# EAGLE schematic InteractionBoard (EAGLE 9.6.2)
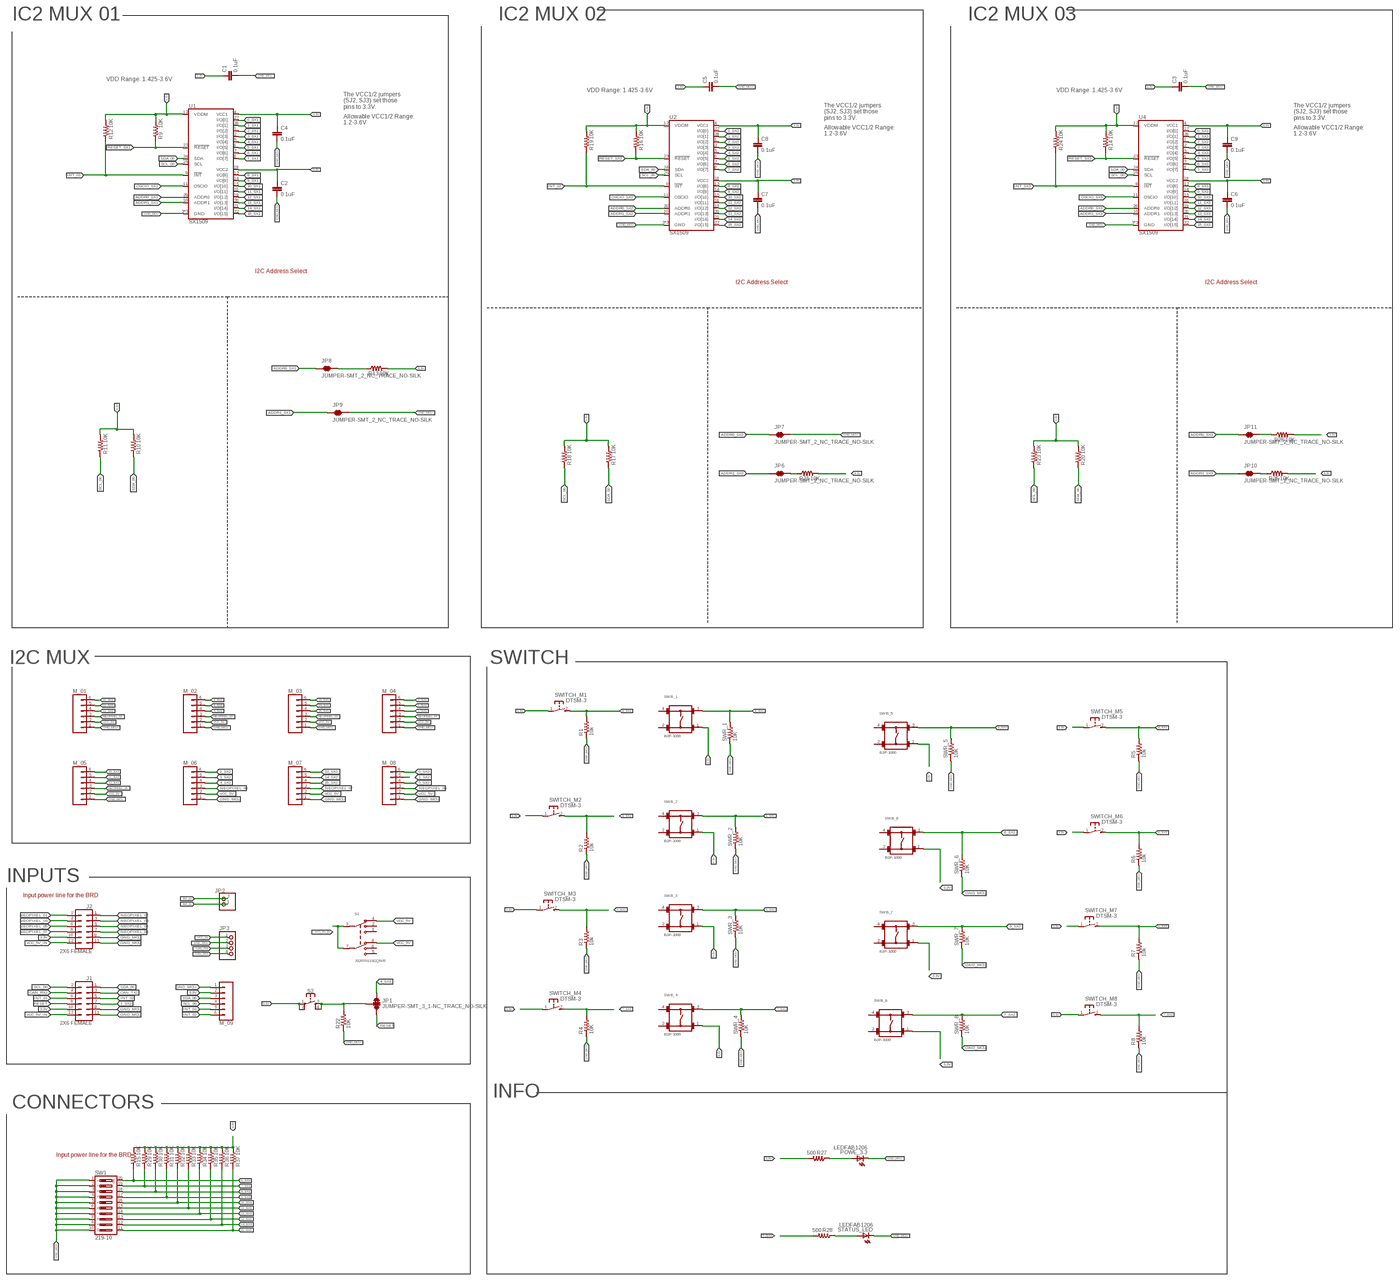
[diagram p0: schematic, sheet 1, overview]
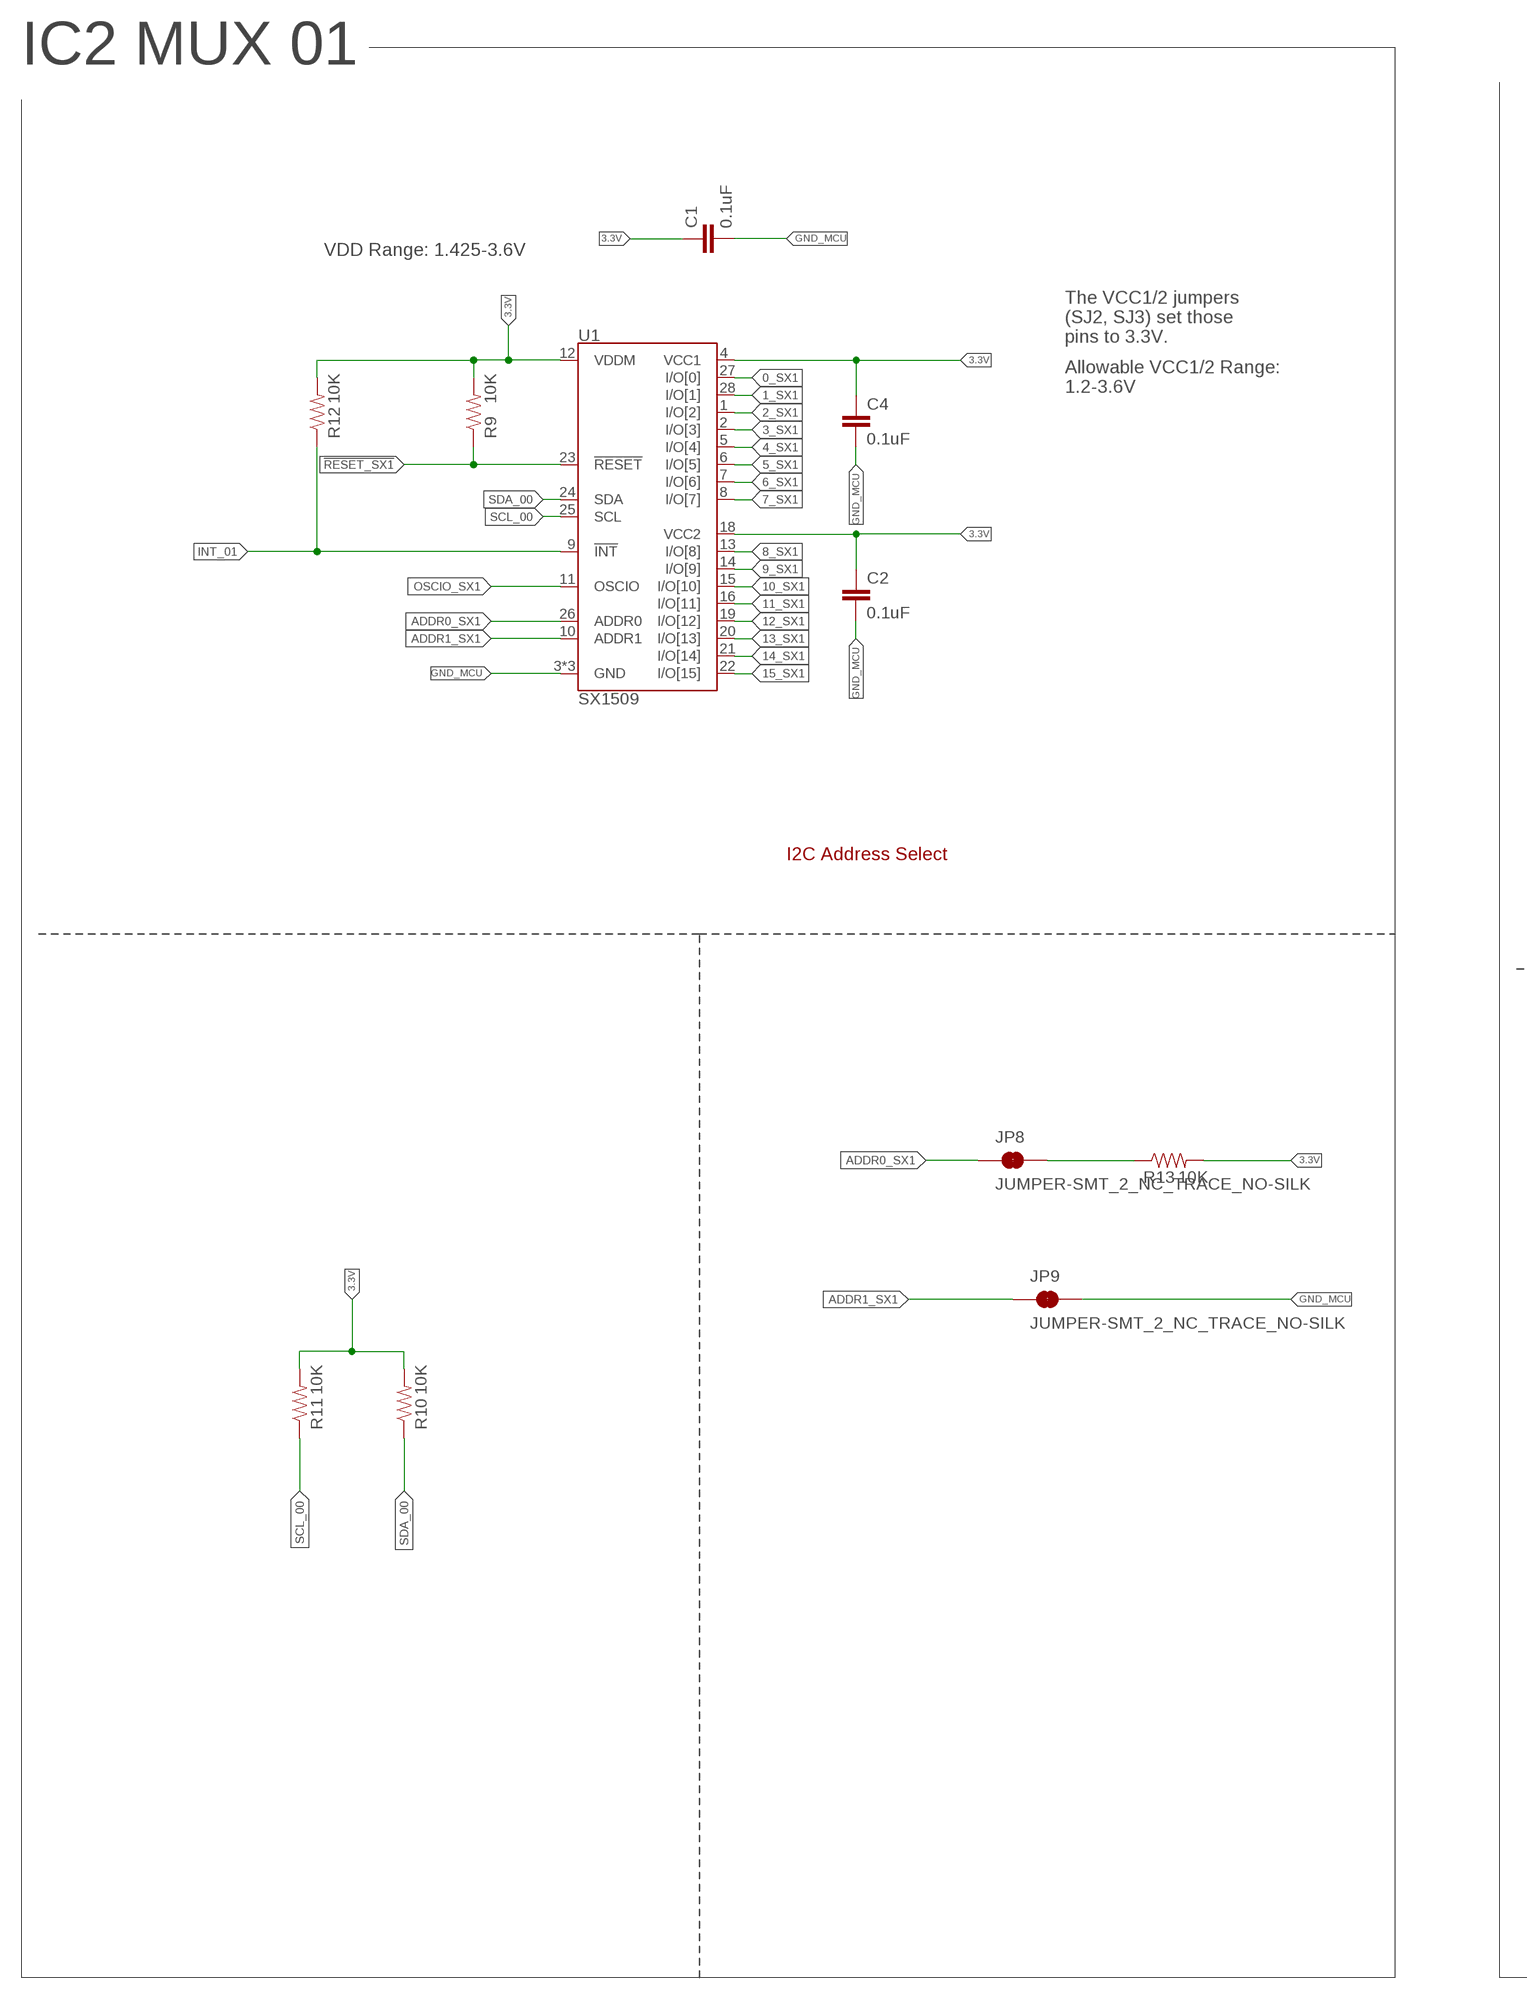
[diagram p1: schematic, sheet 1, part 1 of 4]
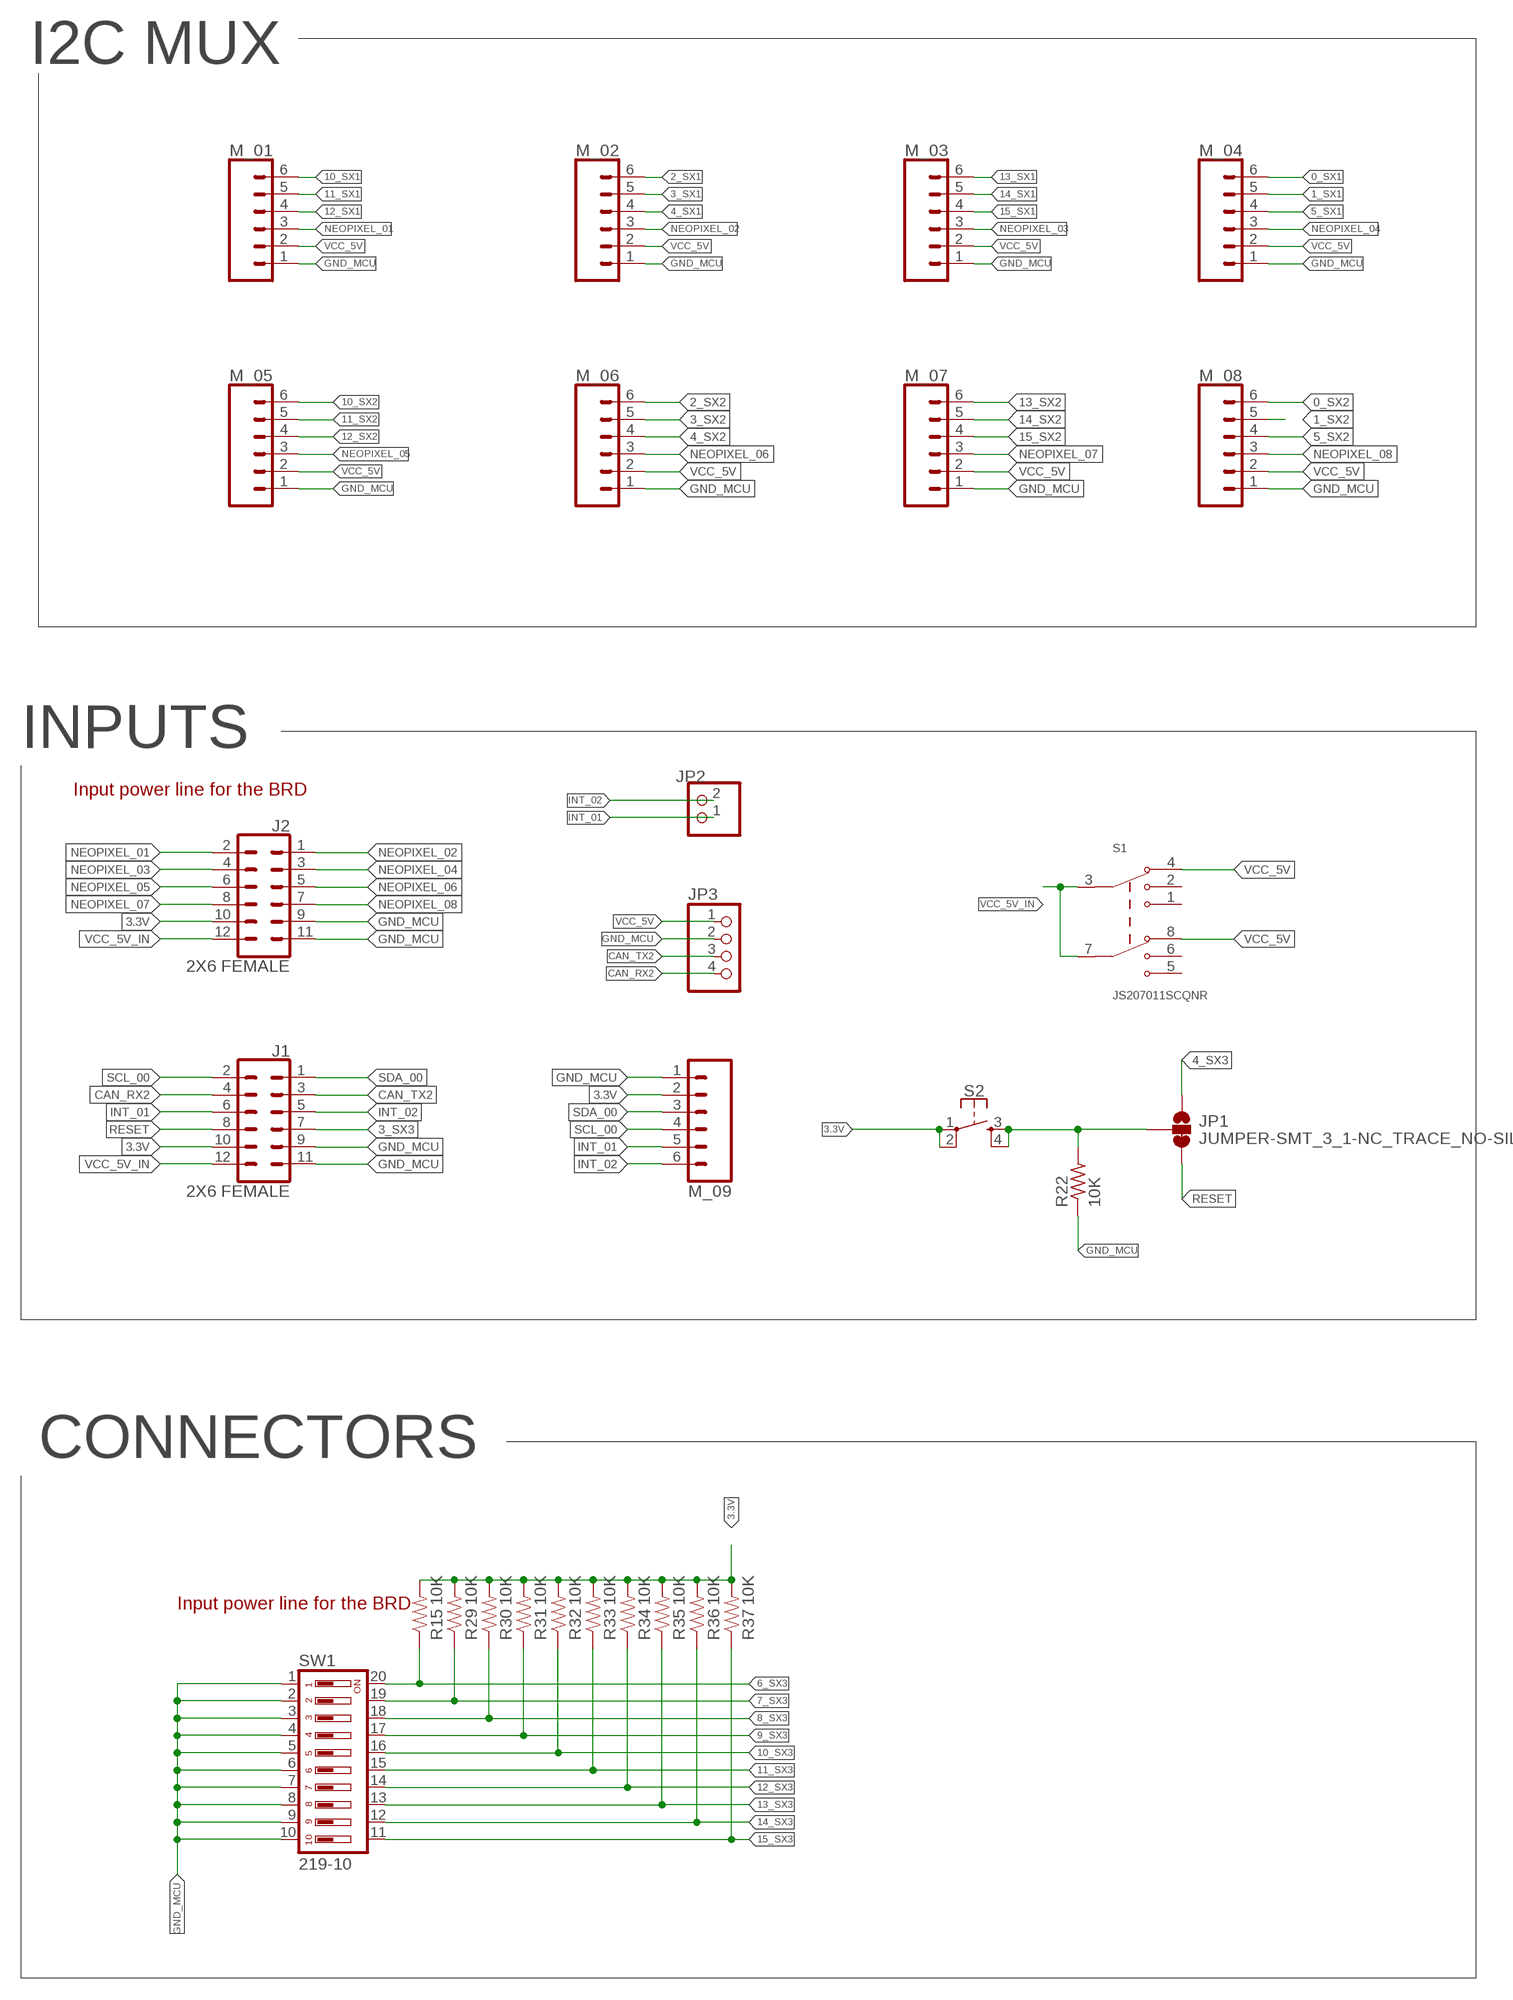
[diagram p2: schematic, sheet 1, part 2 of 4]
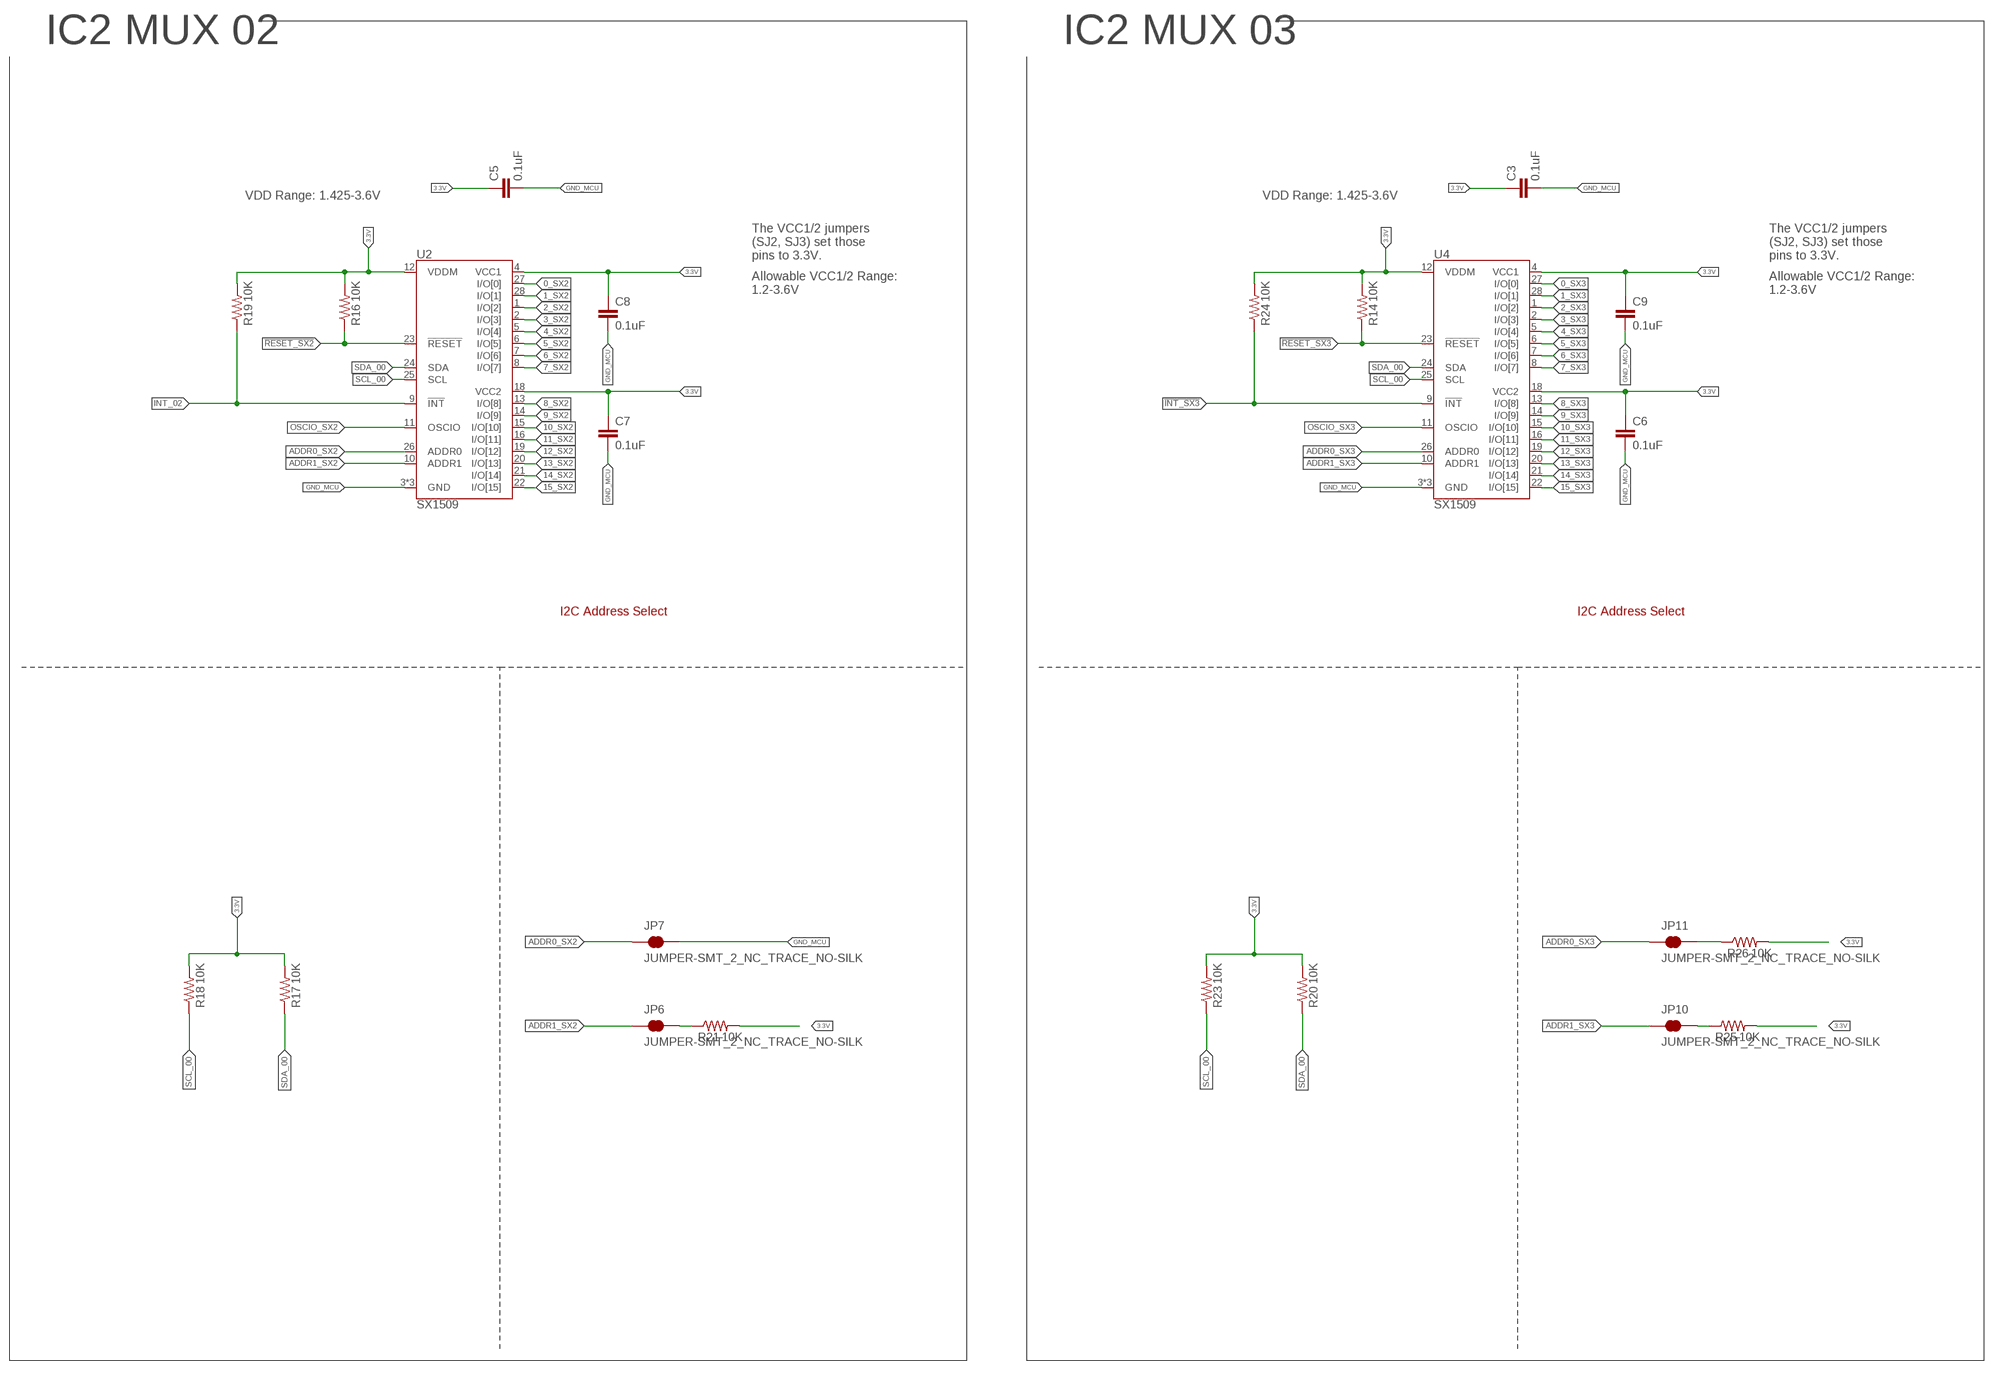
[diagram p3: schematic, sheet 1, part 3 of 4]
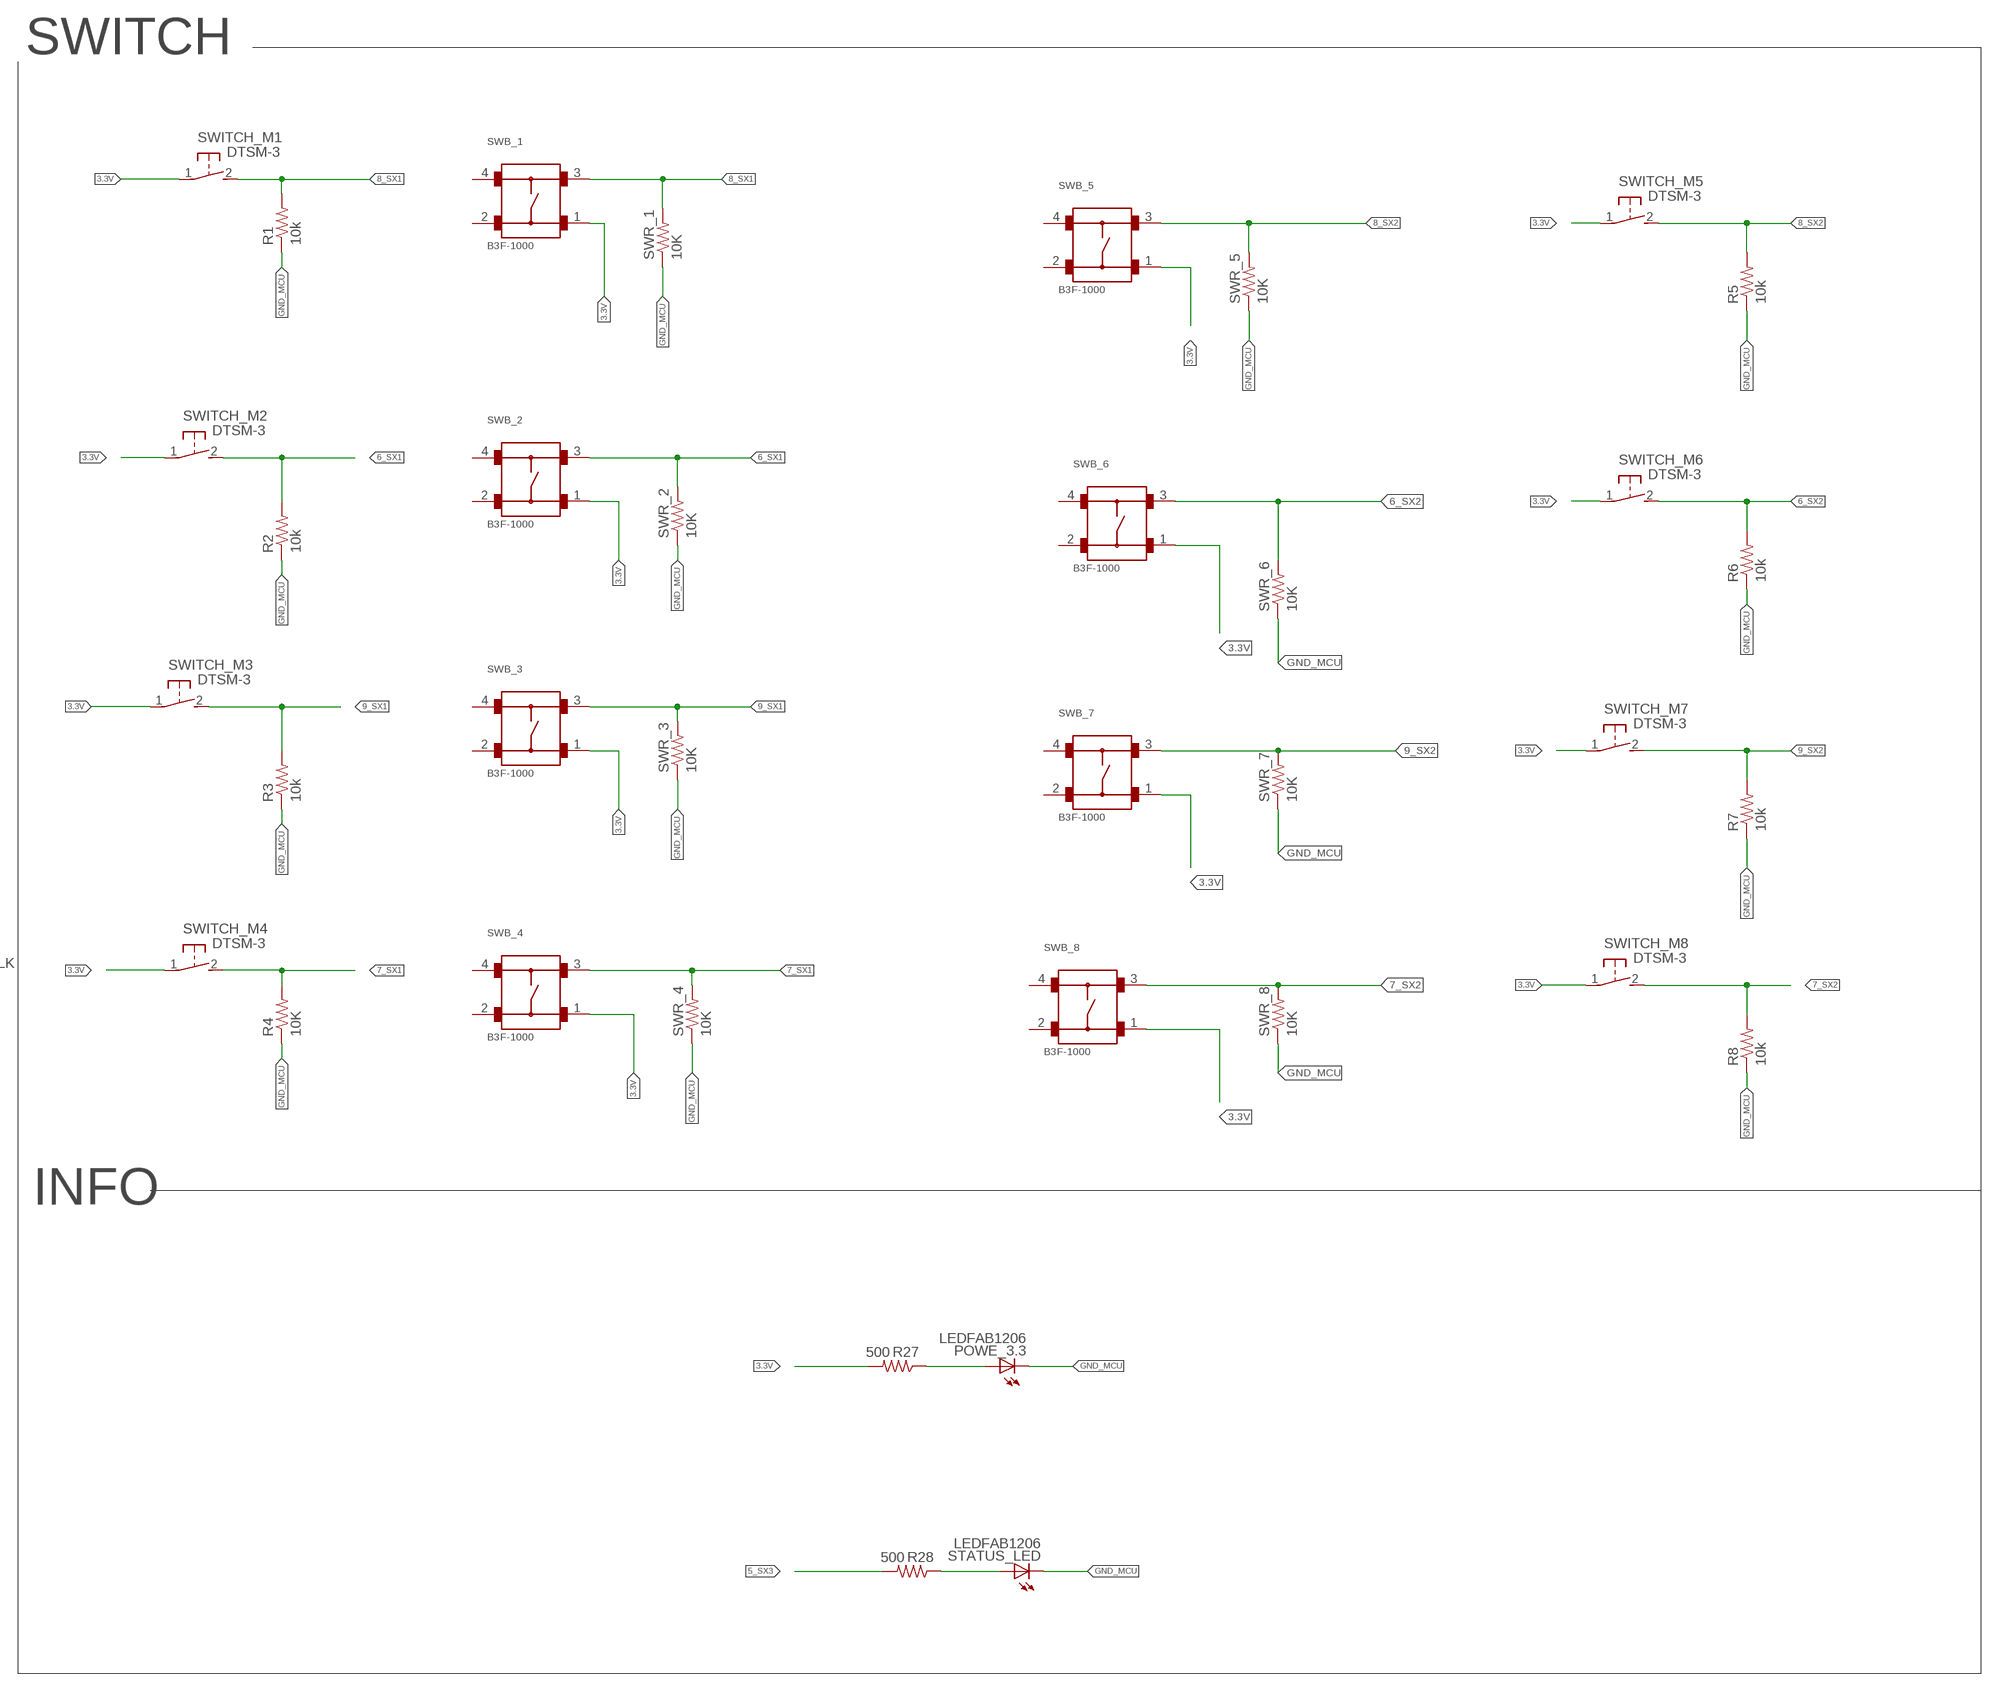
[diagram p4: schematic, sheet 1, part 4 of 4]

## Parts
C1  0.1uF  0.1UF-25V(+80/-20%)(0603)  [0603-CAP]
C2  0.1uF  0.1UF-25V(+80/-20%)(0603)  [0603-CAP]
C3  0.1uF  0.1UF-25V(+80/-20%)(0603)  [0603-CAP]
C4  0.1uF  0.1UF-25V(+80/-20%)(0603)  [0603-CAP]
C5  0.1uF  0.1UF-25V(+80/-20%)(0603)  [0603-CAP]
C6  0.1uF  0.1UF-25V(+80/-20%)(0603)  [0603-CAP]
C7  0.1uF  0.1UF-25V(+80/-20%)(0603)  [0603-CAP]
C8  0.1uF  0.1UF-25V(+80/-20%)(0603)  [0603-CAP]
C9  0.1uF  0.1UF-25V(+80/-20%)(0603)  [0603-CAP]
J1  2X6 FEMALE  CONN_06X2PTH_FEMALE  [2X6]
J2  2X6 FEMALE  CONN_06X2PTH_FEMALE  [2X6]
JP1  JUMPER-SMT_3_1-NC_TRACE_NO-SILK  [SMT-JUMPER_3_1-NC_TRACE_NO-SILK]
JP2  HEADER-1X2ROUND  [1X02_ROUND]
JP3  HEADER-1X4ROUND  [1X04_ROUND]
JP6  JUMPER-SMT_2_NC_TRACE_NO-SILK  [SMT-JUMPER_2_NC_TRACE_NO-SILK]
JP7  JUMPER-SMT_2_NC_TRACE_NO-SILK  [SMT-JUMPER_2_NC_TRACE_NO-SILK]
JP8  JUMPER-SMT_2_NC_TRACE_NO-SILK  [SMT-JUMPER_2_NC_TRACE_NO-SILK]
JP9  JUMPER-SMT_2_NC_TRACE_NO-SILK  [SMT-JUMPER_2_NC_TRACE_NO-SILK]
JP10  JUMPER-SMT_2_NC_TRACE_NO-SILK  [SMT-JUMPER_2_NC_TRACE_NO-SILK]
JP11  JUMPER-SMT_2_NC_TRACE_NO-SILK  [SMT-JUMPER_2_NC_TRACE_NO-SILK]
M_01  CONN_06SMD-1MM  [1X06-1MM]
M_02  CONN_06SMD-1MM  [1X06-1MM]
M_03  CONN_06SMD-1MM  [1X06-1MM]
M_04  CONN_06SMD-1MM  [1X06-1MM]
M_05  CONN_06SMD-1MM  [1X06-1MM]
M_06  CONN_06SMD-1MM  [1X06-1MM]
M_07  CONN_06SMD-1MM  [1X06-1MM]
M_08  CONN_06SMD-1MM  [1X06-1MM]
M_09  CONN_06SMD-1MM  [1X06-1MM]
POWE_3.3  LEDFAB1206  [LED1206FAB]
R1  10k  R-US_M0805  [M0805]
R2  10k  R-US_M0805  [M0805]
R3  10k  R-US_M0805  [M0805]
R4  10K  R-US_M0805  [M0805]
R5  10k  R-US_M0805  [M0805]
R6  10k  R-US_M0805  [M0805]
R7  10k  R-US_M0805  [M0805]
R8  10k  R-US_M0805  [M0805]
R9  10K  10KOHM-1/10W-1%(0603)0603  [0603-RES]
R10  10K  10KOHM-1/10W-1%(0603)0603  [0603-RES]
R11  10K  10KOHM-1/10W-1%(0603)0603  [0603-RES]
R12  10K  10KOHM-1/10W-1%(0603)0603  [0603-RES]
R13  10K  10KOHM-1/10W-1%(0603)0603  [0603-RES]
R14  10K  10KOHM-1/10W-1%(0603)0603  [0603-RES]
R15  10K  10KOHM-1/10W-1%(0603)0603  [0603-RES]
R16  10K  10KOHM-1/10W-1%(0603)0603  [0603-RES]
R17  10K  10KOHM-1/10W-1%(0603)0603  [0603-RES]
R18  10K  10KOHM-1/10W-1%(0603)0603  [0603-RES]
R19  10K  10KOHM-1/10W-1%(0603)0603  [0603-RES]
R20  10K  10KOHM-1/10W-1%(0603)0603  [0603-RES]
R21  10K  10KOHM-1/10W-1%(0603)0603  [0603-RES]
R22  10K  R-US_M0805  [M0805]
R23  10K  10KOHM-1/10W-1%(0603)0603  [0603-RES]
R24  10K  10KOHM-1/10W-1%(0603)0603  [0603-RES]
R25  10K  10KOHM-1/10W-1%(0603)0603  [0603-RES]
R26  10K  10KOHM-1/10W-1%(0603)0603  [0603-RES]
R27  500  10KOHM-1/10W-1%(0603)0603  [0603-RES]
R28  500  10KOHM-1/10W-1%(0603)0603  [0603-RES]
R29  10K  10KOHM-1/10W-1%(0603)0603  [0603-RES]
R30  10K  10KOHM-1/10W-1%(0603)0603  [0603-RES]
R31  10K  10KOHM-1/10W-1%(0603)0603  [0603-RES]
R32  10K  10KOHM-1/10W-1%(0603)0603  [0603-RES]
R33  10K  10KOHM-1/10W-1%(0603)0603  [0603-RES]
R34  10K  10KOHM-1/10W-1%(0603)0603  [0603-RES]
R35  10K  10KOHM-1/10W-1%(0603)0603  [0603-RES]
R36  10K  10KOHM-1/10W-1%(0603)0603  [0603-RES]
R37  10K  10KOHM-1/10W-1%(0603)0603  [0603-RES]
S1  JS207011SCQNR  [SW_JS207011SCQNR]
S2  MOMENTARY-SWITCH-SPST-2-SMD-5.2MM  [TACTILE_SWITCH_SMD_5.2MM]
STATUS_LED  LEDFAB1206  [LED1206FAB]
SW1  219-10  [CTS-219-10]
SWB_1  B3F-1000  [B3F-1000]
SWB_2  B3F-1000  [B3F-1000]
SWB_3  B3F-1000  [B3F-1000]
SWB_4  B3F-1000  [B3F-1000]
SWB_5  B3F-1000  [B3F-1000]
SWB_6  B3F-1000  [B3F-1000]
SWB_7  B3F-1000  [B3F-1000]
SWB_8  B3F-1000  [B3F-1000]
SWITCH_M1  DTSM-3  [DTSM-3]
SWITCH_M2  DTSM-3  [DTSM-3]
SWITCH_M3  DTSM-3  [DTSM-3]
SWITCH_M4  DTSM-3  [DTSM-3]
SWITCH_M5  DTSM-3  [DTSM-3]
SWITCH_M6  DTSM-3  [DTSM-3]
SWITCH_M7  DTSM-3  [DTSM-3]
SWITCH_M8  DTSM-3  [DTSM-3]
SWR_1  10K  R-US_M0805  [M0805]
SWR_2  10K  R-US_M0805  [M0805]
SWR_3  10K  R-US_M0805  [M0805]
SWR_4  10K  R-US_M0805  [M0805]
SWR_5  10K  R-US_M0805  [M0805]
SWR_6  10K  R-US_M0805  [M0805]
SWR_7  10K  R-US_M0805  [M0805]
SWR_8  10K  R-US_M0805  [M0805]
U1  SX1509  [QFN-28]
U2  SX1509  [QFN-28]
U4  SX1509  [QFN-28]

## Nets
0_SX1: M_04.6 U1.27(I/O[0])
0_SX2: M_08.6 U2.27(I/O[0])
0_SX3: U4.27(I/O[0])
1_SX1: M_04.5 U1.28(I/O[1])
1_SX2: M_08.5 U2.28(I/O[1])
1_SX3: U4.28(I/O[1])
2_SX1: M_02.6 U1.1(I/O[2])
2_SX2: M_06.6 U2.1(I/O[2])
2_SX3: U4.1(I/O[2])
3.3V [3v]: C1.1 C2.1 C3.1 C4.1 C5.1 C6.1 C7.1 C8.1 C9.1 J1.10 J2.10 M_09.2 R9.2 R10.2 R11.2 R12.2 R13.2 R14.2 R15.2 R16.2 R17.2 R18.2 R19.2 R20.2 R21.2 R23.2 R24.2 R25.2 R26.2 R27.2 R29.2 R30.2 R31.2 R32.2 R33.2 R34.2 R35.2 R36.2 R37.2 S2.1 S2.2 SWB_1.1 SWB_2.1 SWB_3.1 SWB_4.1 SWB_5.1 SWB_6.1 SWB_7.1 SWB_8.1 SWITCH_M1.1 SWITCH_M2.1 SWITCH_M3.1 SWITCH_M4.1 SWITCH_M5.1 SWITCH_M6.1 SWITCH_M7.1 SWITCH_M8.1 U1.4(VCC1) U1.12(VDDM) U1.18(VCC2) U2.4(VCC1) U2.12(VDDM) U2.18(VCC2) U4.4(VCC1) U4.12(VDDM) U4.18(VCC2)
3_SX1: M_02.5 U1.2(I/O[3])
3_SX2: M_06.5 U2.2(I/O[3])
3_SX3: J1.7 U4.2(I/O[3])
4_SX1: M_02.4 U1.5(I/O[4])
4_SX2: M_06.4 U2.5(I/O[4])
4_SX3: JP1.1 U4.5(I/O[4])
5_SX1: M_04.4 U1.6(I/O[5])
5_SX2: M_08.4 U2.6(I/O[5])
5_SX3: R28.2 U4.6(I/O[5])
6_SX1: R2.2 SWB_2.3 SWITCH_M2.2 SWR_2.2 U1.7(I/O[6])
6_SX2: R6.2 SWB_6.3 SWITCH_M6.2 SWR_6.2 U2.7(I/O[6])
6_SX3: R15.1 SW1.20 U4.7(I/O[6])
7_SX1: R4.2 SWB_4.3 SWITCH_M4.2 SWR_4.2 U1.8(I/O[7])
7_SX2: R8.2 SWB_8.3 SWITCH_M8.2 SWR_8.2 U2.8(I/O[7])
7_SX3: R29.1 SW1.19 U4.8(I/O[7])
8_SX1: R1.2 SWB_1.3 SWITCH_M1.2 SWR_1.2 U1.13(I/O[8])
8_SX2: R5.2 SWB_5.3 SWITCH_M5.2 SWR_5.2 U2.13(I/O[8])
8_SX3: R30.1 SW1.18 U4.13(I/O[8])
9_SX1: R3.2 SWB_3.3 SWITCH_M3.2 SWR_3.2 U1.14(I/O[9])
9_SX2: R7.2 SWB_7.3 SWITCH_M7.2 SWR_7.2 U2.14(I/O[9])
9_SX3: R31.1 SW1.17 U4.14(I/O[9])
10_SX1: M_01.6 U1.15(I/O[10])
10_SX2: M_05.6 U2.15(I/O[10])
10_SX3: R32.1 SW1.16 U4.15(I/O[10])
11_SX1: M_01.5 U1.16(I/O[11])
11_SX2: M_05.5 U2.16(I/O[11])
11_SX3: R33.1 SW1.15 U4.16(I/O[11])
12_SX1: M_01.4 U1.19(I/O[12])
12_SX2: M_05.4 U2.19(I/O[12])
12_SX3: R34.1 SW1.14 U4.19(I/O[12])
13_SX1: M_03.6 U1.20(I/O[13])
13_SX2: M_07.6 U2.20(I/O[13])
13_SX3: R35.1 SW1.13 U4.20(I/O[13])
14_SX1: M_03.5 U1.21(I/O[14])
14_SX2: M_07.5 U2.21(I/O[14])
14_SX3: R36.1 SW1.12 U4.21(I/O[14])
15_SX1: M_03.4 U1.22(I/O[15])
15_SX2: M_07.4 U2.22(I/O[15])
15_SX3: R37.1 SW1.11 U4.22(I/O[15])
!INT_SX3: R24.1 U4.9(!INT)
!RESET_SX1: R9.1 U1.23(!RESET)
!RESET_SX2: R16.1 U2.23(!RESET)
!RESET_SX3: R14.1 U4.23(!RESET)
ADDR0_SX1: JP8.1 U1.26(ADDR0)
ADDR0_SX2: JP7.1 U2.26(ADDR0)
ADDR0_SX3: JP11.1 U4.26(ADDR0)
ADDR1_SX1: JP9.1 U1.10(ADDR1)
ADDR1_SX2: JP6.1 U2.10(ADDR1)
ADDR1_SX3: JP10.1 U4.10(ADDR1)
CAN_RX2: J1.4 JP3.4
CAN_TX2: J1.3 JP3.3
GND_MCU: C1.2 C2.2 C3.2 C4.2 C5.2 C6.2 C7.2 C8.2 C9.2 J1.9 J1.11 J2.9 J2.11 JP3.2 JP7.2 JP9.2 M_01.1 M_02.1 M_03.1 M_04.1 M_05.1 M_06.1 M_07.1 M_08.1 M_09.1 POWE_3.3.2(C) R1.1 R2.1 R3.1 R4.1 R5.1 R6.1 R7.1 R8.1 R22.1 STATUS_LED.2(C) SW1.1 SW1.2 SW1.3 SW1.4 SW1.5 SW1.6 SW1.7 SW1.8 SW1.9 SW1.10 SWR_1.1 SWR_2.1 SWR_3.1 SWR_4.1 SWR_5.1 SWR_6.1 SWR_7.1 SWR_8.1 U1.3(GND) U1.17(GND) U1.29(GND) U2.3(GND) U2.17(GND) U2.29(GND) U4.3(GND) U4.17(GND) U4.29(GND)
INT_01: J1.6 JP2.1 M_09.5 R12.1 U1.9(!INT)
INT_02: J1.5 JP2.2 M_09.6 R19.1 U2.9(!INT)
N$5: JP6.2 R21.1
N$8: JP8.2 R13.1
N$13: R28.1 STATUS_LED.1(A)
N$14: JP10.2 R25.1
N$15: JP11.2 R26.1
N$193: POWE_3.3.1(A) R27.1
NEOPIXEL_01: J2.2 M_01.3
NEOPIXEL_02: J2.1 M_02.3
NEOPIXEL_03: J2.4 M_03.3
NEOPIXEL_04: J2.3 M_04.3
NEOPIXEL_05: J2.6 M_05.3
NEOPIXEL_06: J2.5 M_06.3
NEOPIXEL_07: J2.8 M_07.3
NEOPIXEL_08: J2.7 M_08.3
OSCIO_SX1: U1.11(OSCIO)
OSCIO_SX2: U2.11(OSCIO)
OSCIO_SX3: U4.11(OSCIO)
RESET: J1.8 JP1.2 JP1.3 R22.2 S2.3 S2.4
SCL_00: J1.2 M_09.4 R11.1 R18.1 R23.1 U1.25(SCL) U2.25(SCL) U4.25(SCL)
SDA_00: J1.1 M_09.3 R10.1 R17.1 R20.1 U1.24(SDA) U2.24(SDA) U4.24(SDA)
VCC_5V [5v]: JP3.1 M_01.2 M_02.2 M_03.2 M_04.2 M_05.2 M_06.2 M_07.2 M_08.2 S1.4 S1.8
VCC_5V_IN [5v]: J1.12 J2.12 S1.3 S1.7
Unconnected: S1.1 S1.2 S1.5 S1.6 SWB_1.2 SWB_1.4 SWB_2.2 SWB_2.4 SWB_3.2 SWB_3.4 SWB_4.2 SWB_4.4 SWB_5.2 SWB_5.4 SWB_6.2 SWB_6.4 SWB_7.2 SWB_7.4 SWB_8.2 SWB_8.4

## Notes on the sheet
- IC2 MUX 01 | IC2 MUX 02 | IC2 MUX 03
- VDD Range: 1.425-3.6V
- VDD Range: 1.425-3.6V | VDD Range: 1.425-3.6V
- The VCC1/2 jumpers 
  (SJ2, SJ3) set those 
  pins to 3.3V.
- Allowable VCC1/2 Range: 
  1.2-3.6V
- The VCC1/2 jumpers 
  (SJ2, SJ3) set those 
  pins to 3.3V.
- The VCC1/2 jumpers 
  (SJ2, SJ3) set those 
  pins to 3.3V.
- Allowable VCC1/2 Range: 
  1.2-3.6V
- Allowable VCC1/2 Range: 
  1.2-3.6V
- I2C Address Select
- I2C Address Select | I2C Address Select
- I2C MUX | SWITCH
- INPUTS
- Input power line for the BRD
- INFO
- CONNECTORS
- Input power line for the BRD

## Library data of the parts
C1-C9 = SparkFun-Capacitors:0.1UF-25V(+80/-20%)(0603): CAP-00810 Ceramic Standard decoupling cap; PROD_ID: CAP-00810
J1 J2 = SparkFun-Connectors:CONN_06X2: Multi connection point. Often used as Generic Header-pin footprint for 0.1 inch spaced/style header connections On any of the 0.1 inch spaced packages, you can populate with these: Break Away Headers - Straight <https://www.sparkfun.com/products/116> (PRT-00116) Break Away Male Headers - Right Angle <https://www.sparkfun.com/products/553> (PRT-00553) Female Headers <https://www.sparkfun.com/products/115> (PRT-00115) Break Away Headers - Machine Pin <https://www.sparkfun.com/products/117> (PRT-00117) Break Away Female Headers - Swiss Machine Pin <https://www.sparkfun.com/products/743> (PRT-00743); PROD_ID: CONN-12423
JP1 = SparkFun-Jumpers:JUMPER-SMT_3_1-NC_TRACE: Normally closed trace jumper (1 of 2 connections) This jumper has a trace between two pads so it's normally closed (NC). The other connection is normally open (NO). Use a razor knife to open the connection. For best results follow the IPC guidelines for cutting traces: Cutout at least 0.063 mm (0.005 in). Remove all loose material to clean up the cut area. Seal the cut with an approved epoxy. Reapply solder to reclose the connection, or to close the NO connection.
JP2 = microbuilder:HEADER-1X2: PIN HEADER
JP3 = microbuilder:HEADER-1X4: PIN HEADER
JP6-JP11 = SparkFun-Jumpers:JUMPER-SMT_2_NC_TRACE: Normally closed trace jumper This jumper has a trace between two pads so it's normally closed (NC). Use a razor knife to open the connection. For best results follow the IPC guidelines for cutting traces: Cutout at least 0.063 mm (0.005 in). Remove all loose material to clean up the cut area. Seal the cut with an approved epoxy. Reapply solder to reclose the connection.
M_01-M_09 = SparkFun-Connectors:CONN_06: Multi connection point. Often used as Generic Header-pin footprint for 0.1 inch spaced/style header connections On any of the 0.1 inch spaced packages, you can populate with these: Break Away Headers - Straight <https://www.sparkfun.com/products/116> (PRT-00116) Break Away Male Headers - Right Angle <https://www.sparkfun.com/products/553> (PRT-00553) Female Headers <https://www.sparkfun.com/products/115> (PRT-00115) Break Away Headers - Machine Pin <https://www.sparkfun.com/products/117> (PRT-00117) Break Away Female Headers - Swiss Machine Pin <https://www.sparkfun.com/products/743> (PRT-00743) Arduino Stackable Header - 6 Pin <https://www.sparkfun.com/products/9280> (PRT-09280) For SCREWTERMINALS and SPRING TERMINALS visit here: Screw Terimnals on SparkFun.com <https://www.sparkfun.com/search/results?term=Screw+Terminals> (5mm/3.5mm/2.54mm spacing) This device is also useful as a general connection point to wire up your design to another part of your project. Our various solder wires solder well into these plated through hole pads. Hook-Up Wire - Assortment (Stranded, 22 AWG) <https://www.sparkfun.com/products/11375> (PRT-11375) Hook-Up Wire - Assortment (Solid Core, 22 AWG) <https://www.sparkfun.com/products/11367> (PRT-11367) View the entire wire category on our website here <https://www.sparkfun.com/categories/141>; PROD_ID: CONN-08249; SF_ID: GPS-00579
POWE_3.3 STATUS_LED = fab:LED: LED
R1-R8 R22 SWR_1-SWR_8 = resistor:R-US_: RESISTOR, American symbol
R9-R21 R23-R26 R29-R37 = SparkFun-Resistors:10KOHM-1/10W-1%(0603): RES-00824; PROD_ID: RES-00824
R27 R28 = SparkFun-Resistors:10KOHM-1/10W-1%(0603): RES-00824; PROD_ID: RES-00824; VALUE: 10K
S1 = JS207011SCQNR:JS207011SCQNR: Js Series Sub-Miniature Slide Switches; AVAILABILITY: Unavailable; DESCRIPTION: Slide Switch DP3T Surface Mount; MF: C&K; MP: JS207011SCQNR; PACKAGE: None; PRICE: None
S2 = SparkFun-Switches:MOMENTARY-SWITCH-SPST-2: Momentary Switch (Pushbutton) - SPST - Two Circuits Normally-open (NO) SPST momentary switches (buttons, pushbuttons). Schematic symbol includes two switch circuits. Variants SMD-4.6MMX2.8MM - 4.60mm x 2.80mm Tactile Momentary Button Switch - Used on SparkFun SAMD21 Mini Breakout <https://www.sparkfun.com/products/13664> SMD-5.2MM - Mini Pushbutton Switch - SMD <https://www.sparkfun.com/products/8720> - Used on Arduino Pro Mini <https://www.sparkfun.com/products/11114>; PROD_ID: SWCH-08247; SF_SKU: COM-08720
SW1 = switch-dil:219-10*: Surface Mount DIP Switch Series 219 SMT CTS Electronic Components Sourc: www.ctscorp.com; MF: SLI (CML/IDI); MPN: 219-10PK; OC_FARNELL: unknown; OC_NEWARK: 19M0224
SWB_1-SWB_8 = Switch:B3F-1000: Tactile Switch SPST-NO Top Actuated Through Hole Manufacturer's datasheet <https://omronfs.omron.com/en_US/ecb/products/pdf/en-b3f.pdf>; CREATED_BY: PCBLayout.com; DIGI_KEY_PART_NUMBER: SW400-ND; MANUFACTURER: Omron Electronics Inc-EMC Div; MPN: B3F-1000; PACKAGE: SPST-NO
SWITCH_M1-SWITCH_M8 = switch-tact:DTSM-3
U1 U2 U4 = SparkFun-DigitalIC:SX1509: Semtech SX1509 The SX1509 is a complete ultra low voltage 1.2V to 3.6V General Purpose parallel Input/Output (GPIO) expanders ideal for low power handheld battery powered equipment. This version comes in a 16-channel configuration and allows easy serial expansion of I/O through a standard 400kHz I2C interface. GPIO devices can provide additional control and monitoring when the microcontroller or chipset has insufficient I/O ports, or in systems where serial communication and control from a remote location is advantageous.; PROD_ID: IC-11311

## Net classes
0 default: width 0.2 mm, clearance 0.2 mm
1 gnd: width 0.2 mm, clearance 0.2 mm to class 0, clearance 0.2 mm
2 3v: width 0.2 mm, clearance 0.2 mm
4 5v: width 0.4 mm, clearance 0.2 mm to class 0, clearance 0.2 mm